# EAGLE design stepup (EAGLE 6.6.0)
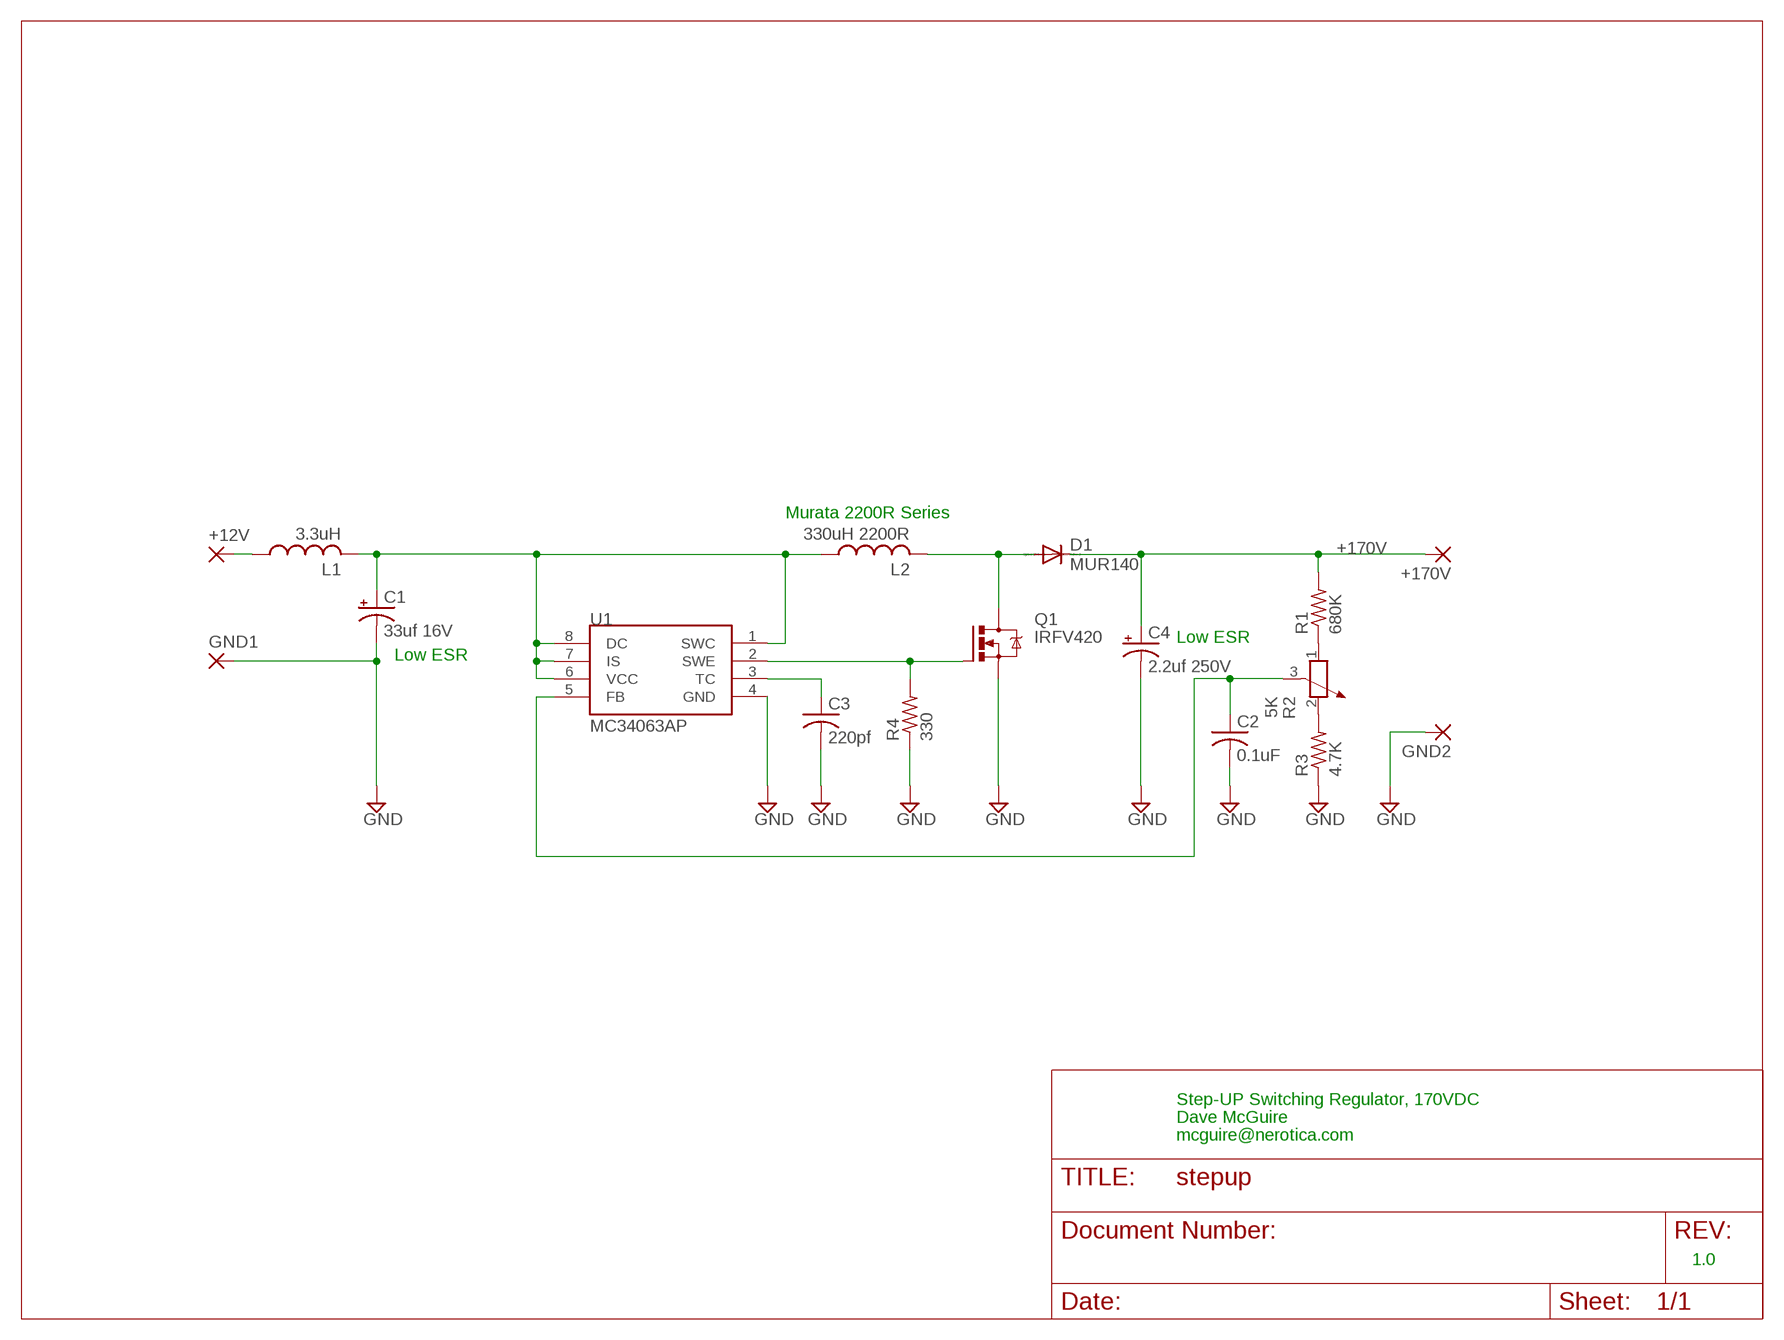
[diagram p0: schematic, sheet 1]

## Parts
+12V  2,54/0,9  [2,54/0,9]
+170V  2,54/0,9  [2,54/0,9]
C1  33uf 16V  CPOL-USE2,5-6E  [E2,5-6E]
C2  0.1uF  C-US050-025X075  [C050-025X075]
C3  220pf  C-US050-025X075  [C050-025X075]
C4  2.2uf 250V  CPOL-USE2,5-6E  [E2,5-6E]
D1  MUR140  MUR150RL  [DO41-10]
GND1  2,54/0,9  [2,54/0,9]
GND2  2,54/0,9  [2,54/0,9]
L1  3.3uH  L-US0207/10  [0207/10]
L2  330uH 2200R  L-US0207/10  [0207/10]
Q1  IRFV420  IRF740  [TO220BV]
R1  680K  R-US_0207/10  [0207/10]
R2  5K  POTENTIOMETER_PT-10S  [PT-10S]
R3  4.7K  R-US_0207/10  [0207/10]
R4  330  R-US_0207/10  [0207/10]
U1  MC34063AP  [DIL08]

## Nets
+170V: +170V.1(P) C4.+ D1.C R1.2
GND: C1.- C2.2 C3.2 C4.- GND1.1(P) GND2.1(P) Q1.S R3.1 R4.1 U1.4(GND)
N$1: C1.+ L1.2 L2.1 U1.1(SWC) U1.6(VCC) U1.7(IS) U1.8(DC)
N$2: C3.1 U1.3(TC)
N$3: Q1.G R4.2 U1.2(SWE)
N$4: C2.1 R2.3 U1.5(FB)
N$5: D1.A L2.2 Q1.D
N$6: R2.2 R3.2
N$7: R1.1 R2.1
N$8: +12V.1(P) L1.1

## Notes on the sheet
- Murata 2200R Series
- Low ESR
- Low ESR
- Step-UP Switching Regulator, 170VDC
- Dave McGuire
- mcguire@nerotica.com
- 1.0

## Library data of the parts
+12V +170V GND1 GND2 = wirepad:2,54/0,9: THROUGH-HOLE PAD
C1 C4 = rcl:CPOL-US: POLARIZED CAPACITOR, American symbol
C2 C3 = rcl:C-US: CAPACITOR, American symbol
D1 = diode:MUR150RL: DIODE
L1 L2 = rcl:L-US: INDUCTOR, American symbol
Q1 = transistor-power:IRF740: N-CHANNEL MOS FET
R1 R3 R4 = rcl:R-US_: RESISTOR, American symbol
R2 = rcl:POTENTIOMETER_: Potentiometer
U1 = mc34063:MC34063

## Net classes
0 default: width 0.508 mm

## Board
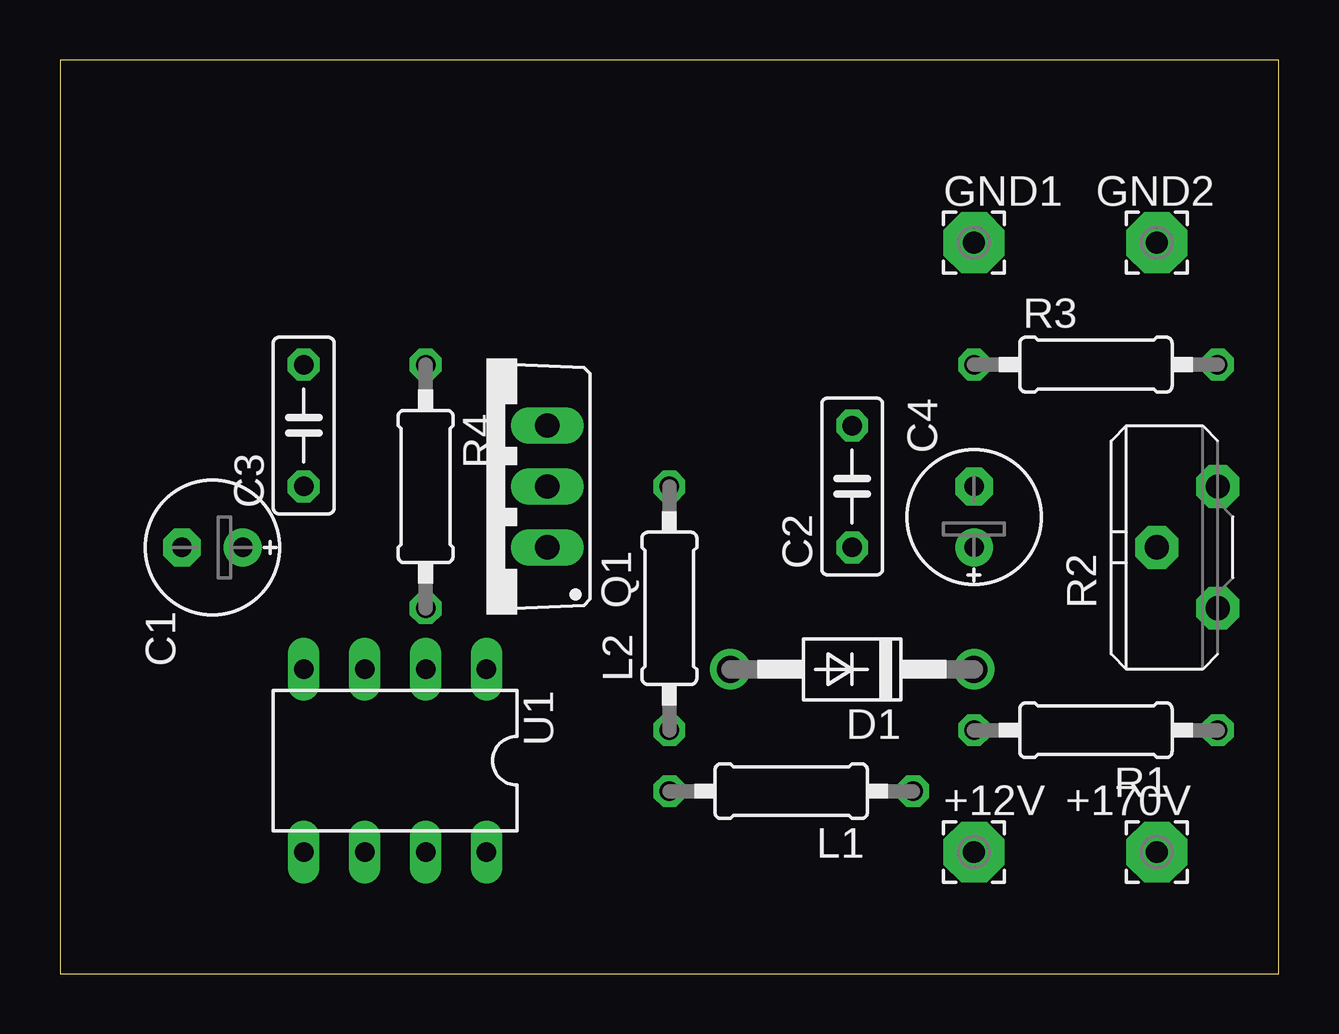
[diagram p1: board, top side]
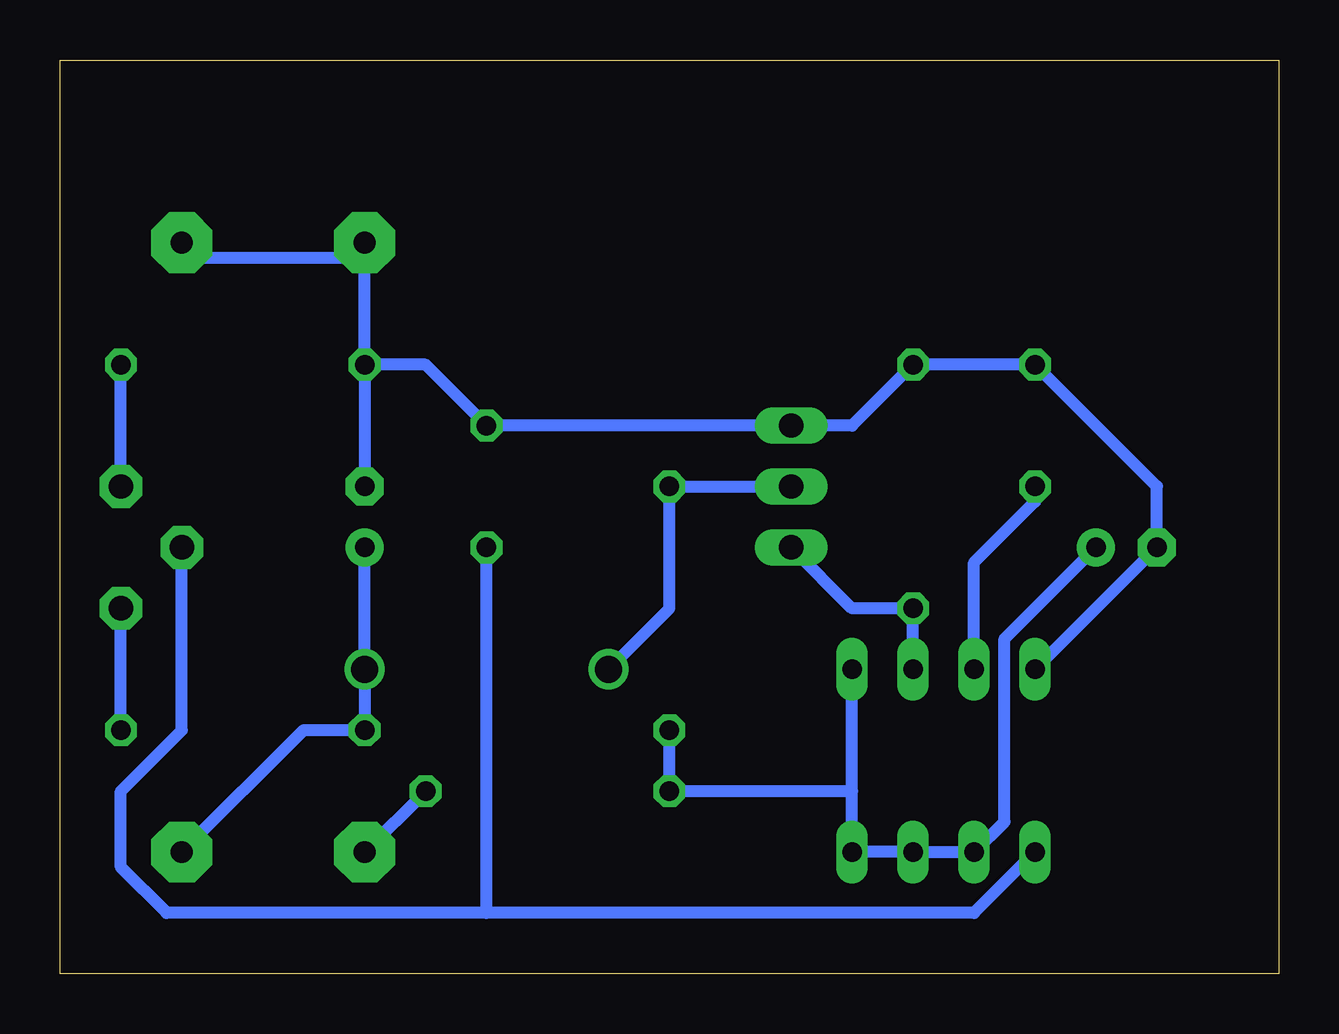
[diagram p2: board, bottom side, seen from below]

Size 50.8 x 38.1 mm. Coordinates in mm from the lower left corner, seen from the top.
Outline: 0,0 50.8,0 50.8,38.1 0,38.1 0,0
Copper layers (1+16): Top 0.035mm / dielectric 1.5mm / Bottom 0.035mm
Design rules "16mils": minimum track width 16mil, minimum drill 32mil, track to track 15mil, track to pad 10mil, pad to pad 10mil, via to via 10mil, smd to smd 10mil, copper to edge 13mil, drill to drill 10mil, minimum pad ring 10mil, minimum via ring 8mil, stop-mask expansion 0mil, vias tented up to drill 0mil, thermal gap 10mil

### Footprints (pad centres in the part's own frame; a part is rotated, then mirrored left to right if it is on the bottom)
2,54/0,9 = drill 0.914 pad 2.54 octagon: 1 0,0
E2,5-6E = drill 0.813 pad 1.575: + -1.27,0 | drill 0.813 pad 1.575 octagon: - 1.27,0
C050-025X075 = drill 0.813 octagon: 1 -2.54,0; 2 2.54,0
DO41-10 = drill 1.118: A 5.08,0; C -5.08,0
0207/10 = drill 0.813 octagon: 1 -5.08,0; 2 5.08,0
TO220BV = drill 1.016 long: D 0,-2.54; G -2.54,-2.54; S 2.54,-2.54
PT-10S = drill 1.016 pad 1.778 octagon: 1 -2.54,-1.27; 2 2.54,-1.27; 3 0,1.27
DIL08 = drill 0.813 long: 1 -3.81,-3.81; 2 -1.27,-3.81; 3 1.27,-3.81; 4 3.81,-3.81; 5 3.81,3.81; 6 1.27,3.81; 7 -1.27,3.81; 8 -3.81,3.81

### Placement (x,y rotation side)
+12V  38.1,5.08 0 top
+170V  45.72,5.08 0 top
C1  6.35,17.78 180 top
C2  33.02,20.32 90 top
C3  10.16,22.86 90 top
C4  38.1,19.05 90 top
D1  33.02,12.7 180 top
GND1  38.1,30.48 0 top
GND2  45.72,30.48 0 top
L1  30.48,7.62 180 top
L2  25.4,15.24 90 top
Q1  17.78,20.32 90 top
R1  43.18,10.16 180 top
R2  46.99,17.78 90 top
R3  43.18,25.4 0 top
R4  15.24,20.32 270 top
U1  13.97,8.89 180 top

### Tracks (layer width: path | path; a pad name or v marks a point on that pad's centre or on a via)
+170V
  Bottom 0.508: C4.+ D1.C R1.2 40.64,10.16 +170V.1
GND
  Bottom 0.508: R3.1 C4.- | R3.1 GND1.1 38.73,29.84 45.09,29.84 GND2.1 | U1.4 C1.- 5.08,20.32 C3.2 R4.1 17.78,22.86 Q1.S C2.2 35.56,25.4 R3.1
N$1
  Bottom 0.508: L2.1 L1.2 17.78,7.62 | 17.78,7.62 U1.1 | 17.78,7.62 U1.8 U1.7 U1.6 11.43,6.35 11.43,13.97 C1.+
N$2
  Bottom 0.508: U1.3 12.7,17.14 10.16,19.68 C3.1
N$3
  Bottom 0.508: U1.2 R4.2 17.78,15.24 Q1.G
N$4
  Bottom 0.508: U1.5 12.7,2.54 33.02,2.54 | 33.02,2.54 C2.1 | R2.3 45.72,10.16 48.26,7.62 48.26,4.45 46.35,2.54 33.02,2.54
N$5
  Bottom 0.508: D1.A 25.4,15.24 L2.2 Q1.D
N$6
  Bottom 0.508: R2.2 R3.2
N$7
  Bottom 0.508: R1.1 R2.1
N$8
  Bottom 0.508: +12V.1 L1.1